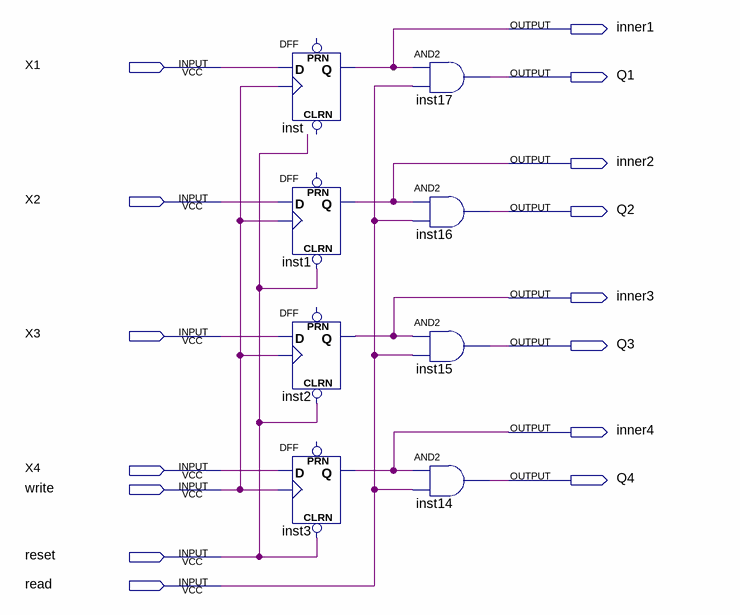
[diagram p0: schematic sheet]
// Quartus schematic MemoryReg.bdf as structural Verilog: 8 symbols, 15 pins
module MemoryReg (
  input  X1,
  input  X2,
  input  X3,
  input  X4,
  input  write,
  input  reset,
  input  read,
  output inner1,
  output Q1,
  output inner2,
  output Q2,
  output inner3,
  output Q3,
  output inner4,
  output Q4
);

  DFF inst (.CLK(write), .D(X1), .Q(inner1));  // open: CLRN, PRN
  DFF inst1 (.CLRN(reset), .CLK(write), .D(X2), .Q(inner2));  // open: PRN
  DFF inst2 (.CLRN(reset), .CLK(write), .D(X3), .Q(inner3));  // open: PRN
  DFF inst3 (.CLRN(reset), .CLK(write), .D(X4), .Q(inner4));  // open: PRN
  and inst17 (Q1, inner1, read);
  and inst16 (Q2, inner2, read);
  and inst15 (Q3, inner3, read);
  and inst14 (Q4, inner4, read);
endmodule
